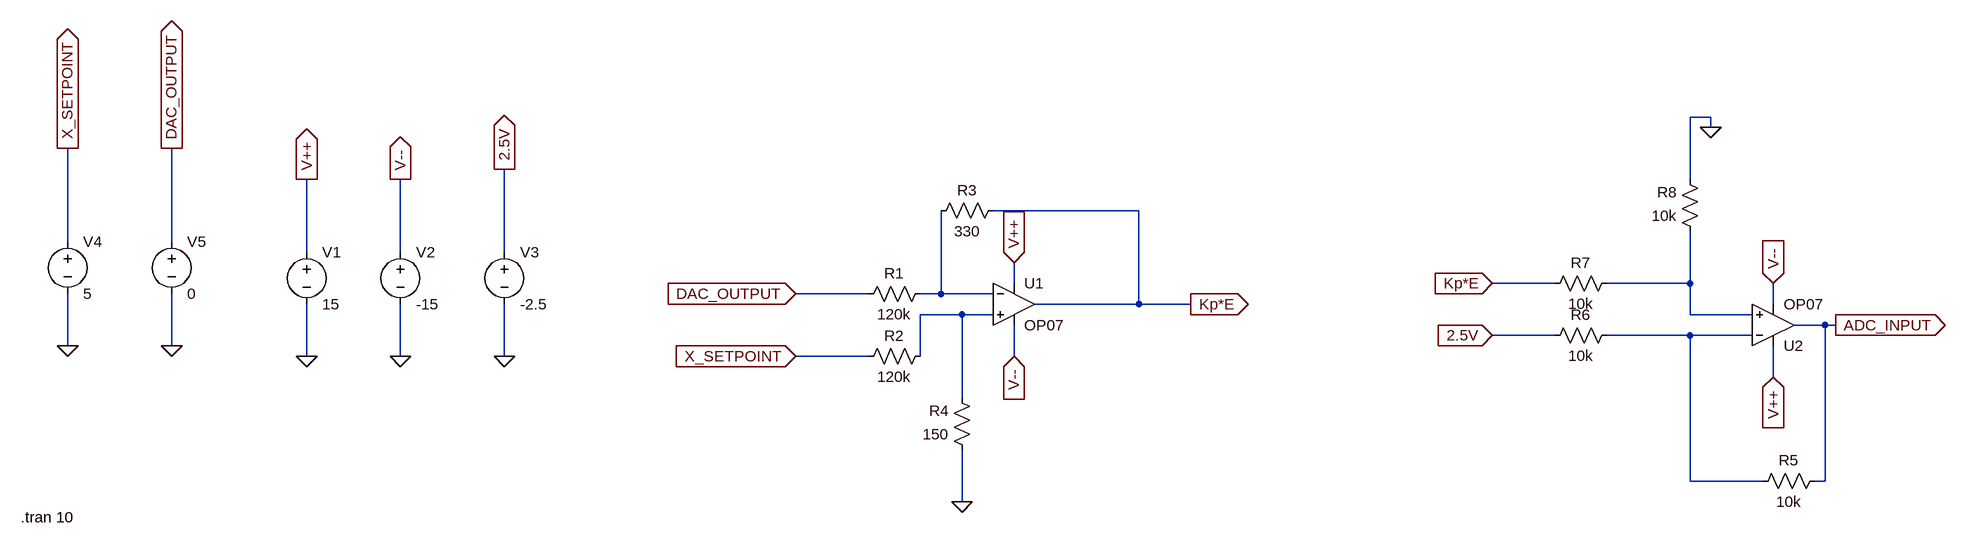
[diagram p0: schematic ControllerCircuit.asc]
ControllerCircuit.asc, the LTspice schematic file:
Version 4
SHEET 1 2132 680
WIRE 1744 -112 1712 -112
WIRE 1744 -96 1744 -112
WIRE 1712 -16 1712 -112
WIRE 864 32 640 32
WIRE -784 80 -784 -64
WIRE -624 80 -624 -64
WIRE -416 96 -416 -16
WIRE -272 96 -272 -16
WIRE -112 96 -112 -32
WIRE 672 144 672 112
WIRE 1504 144 1408 144
WIRE 1712 144 1712 64
WIRE 1712 144 1584 144
WIRE 448 160 336 160
WIRE 560 160 560 32
WIRE 560 160 528 160
WIRE 640 160 560 160
WIRE 864 176 864 32
WIRE 864 176 704 176
WIRE 944 176 864 176
WIRE 1840 176 1840 144
WIRE 592 192 528 192
WIRE 640 192 592 192
WIRE 1712 192 1712 144
WIRE 1808 192 1712 192
WIRE 1920 208 1872 208
WIRE 1936 208 1920 208
WIRE 1504 224 1408 224
WIRE 1712 224 1584 224
WIRE 1808 224 1712 224
WIRE -784 240 -784 160
WIRE -624 240 -624 160
WIRE -416 256 -416 176
WIRE -272 256 -272 176
WIRE -112 256 -112 176
WIRE 448 256 336 256
WIRE 528 256 528 192
WIRE 672 256 672 208
WIRE 1840 288 1840 240
WIRE 592 320 592 192
WIRE 1712 448 1712 224
WIRE 1824 448 1712 448
WIRE 1920 448 1920 208
WIRE 1920 448 1904 448
WIRE 592 480 592 400
FLAG -416 -16 V++
IOPIN -416 -16 Out
FLAG -272 -16 V--
IOPIN -272 -16 Out
FLAG 672 112 V++
IOPIN 672 112 In
FLAG 672 256 V--
IOPIN 672 256 In
FLAG -272 256 0
FLAG -416 256 0
FLAG 944 176 Kp*E
IOPIN 944 176 Out
FLAG 592 480 0
FLAG 336 256 X_SETPOINT
IOPIN 336 256 In
FLAG 336 160 DAC_OUTPUT
IOPIN 336 160 In
FLAG 1408 144 Kp*E
IOPIN 1408 144 In
FLAG -112 256 0
FLAG -112 -32 2.5V
IOPIN -112 -32 Out
FLAG 1408 224 2.5V
IOPIN 1408 224 In
FLAG 1936 208 ADC_INPUT
IOPIN 1936 208 Out
FLAG 1840 288 V++
IOPIN 1840 288 In
FLAG 1840 144 V--
IOPIN 1840 144 In
FLAG -784 240 0
FLAG -624 240 0
FLAG -784 -64 X_SETPOINT
IOPIN -784 -64 Out
FLAG -624 -64 DAC_OUTPUT
IOPIN -624 -64 Out
FLAG 1744 -96 0
SYMBOL OpAmps\\OP07 672 112 R0
SYMATTR InstName U1
SYMBOL voltage -416 80 R0
WINDOW 123 0 0 Left 0
WINDOW 39 0 0 Left 0
SYMATTR InstName V1
SYMATTR Value 15
SYMBOL voltage -272 80 R0
WINDOW 123 0 0 Left 0
WINDOW 39 0 0 Left 0
SYMATTR InstName V2
SYMATTR Value -15
SYMBOL res 544 144 R90
WINDOW 0 0 56 VBottom 2
WINDOW 3 32 56 VTop 2
SYMATTR InstName R1
SYMATTR Value 120k
SYMATTR SpiceLine tol=10
SYMBOL res 544 240 R90
WINDOW 0 0 56 VBottom 2
WINDOW 3 32 56 VTop 2
SYMATTR InstName R2
SYMATTR Value 120k
SYMATTR SpiceLine tol=10
SYMBOL res 656 16 R90
WINDOW 0 0 56 VBottom 2
WINDOW 3 32 56 VTop 2
SYMATTR InstName R3
SYMATTR Value 330
SYMATTR SpiceLine tol=10
SYMBOL res 608 416 R180
WINDOW 0 36 76 Left 2
WINDOW 3 36 40 Left 2
SYMATTR InstName R4
SYMATTR Value 150
SYMATTR SpiceLine tol=10
SYMBOL OpAmps\\OP07 1840 272 M180
SYMATTR InstName U2
SYMBOL res 1920 432 R90
WINDOW 0 0 56 VBottom 2
WINDOW 3 32 56 VTop 2
SYMATTR InstName R5
SYMATTR Value 10k
SYMATTR SpiceLine tol=10
SYMBOL res 1600 208 R90
WINDOW 0 0 56 VBottom 2
WINDOW 3 32 56 VTop 2
SYMATTR InstName R6
SYMATTR Value 10k
SYMATTR SpiceLine tol=10
SYMBOL voltage -112 80 R0
WINDOW 123 0 0 Left 0
WINDOW 39 0 0 Left 0
SYMATTR InstName V3
SYMATTR Value -2.5
SYMBOL res 1600 128 R90
WINDOW 0 0 56 VBottom 2
WINDOW 3 32 56 VTop 2
SYMATTR InstName R7
SYMATTR Value 10k
SYMATTR SpiceLine tol=10
SYMBOL voltage -784 64 R0
WINDOW 123 0 0 Left 0
WINDOW 39 0 0 Left 0
SYMATTR InstName V4
SYMATTR Value 5
SYMBOL voltage -624 64 R0
WINDOW 123 0 0 Left 0
WINDOW 39 0 0 Left 0
SYMATTR InstName V5
SYMATTR Value 0
SYMBOL res 1728 80 R180
WINDOW 0 36 76 Left 2
WINDOW 3 36 40 Left 2
SYMATTR InstName R8
SYMATTR Value 10k
SYMATTR SpiceLine tol=10
TEXT -856 504 Left 2 !.tran 10

The netlist it stands for:
* ControllerCircuit.asc
XU1 N003 N002 V++ V-- Kp*E LT1001  ; OP07, pins In+ In- V+ V- OUT
V1 V++ 0 15
V2 V-- 0 -15
R1 N002 DAC_OUTPUT 120k tol=10
R2 N003 X_SETPOINT 120k tol=10
R3 Kp*E N002 330 tol=10
R4 0 N003 150 tol=10
XU2 N001 N004 V++ V-- ADC_INPUT LT1001  ; OP07, pins In+ In- V+ V- OUT
R5 ADC_INPUT N004 10k tol=10
R6 N004 2.5V 10k tol=10
V3 2.5V 0 -2.5
R7 N001 Kp*E 10k tol=10
V4 X_SETPOINT 0 5
V5 DAC_OUTPUT 0 0
R8 N001 0 10k tol=10
.tran 10
.lib LTC.lib
.backanno
.end